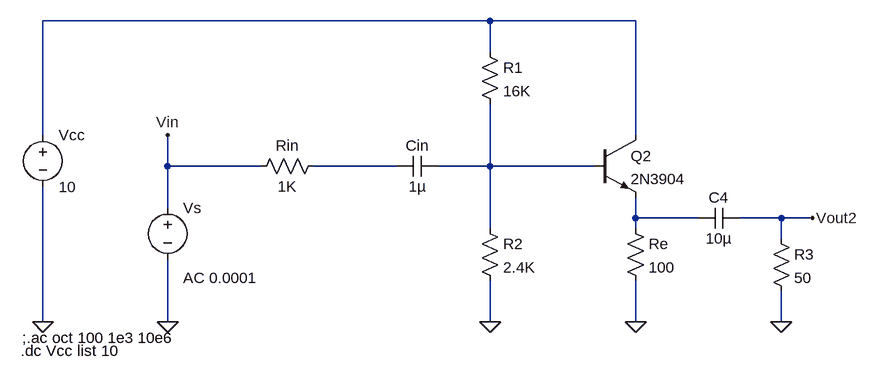
[diagram p0: schematic transistor_common_collector.asc]
transistor_common_collector.asc, the LTspice schematic file:
Version 4
SHEET 1 1368 680
WIRE 240 32 -448 32
WIRE 464 32 240 32
WIRE 240 80 240 32
WIRE -448 208 -448 32
WIRE 464 208 464 32
WIRE -256 256 -256 208
WIRE -112 256 -256 256
WIRE 96 256 -32 256
WIRE 240 256 240 160
WIRE 240 256 160 256
WIRE 400 256 240 256
WIRE -256 320 -256 256
WIRE 464 336 464 304
WIRE 560 336 464 336
WIRE 688 336 624 336
WIRE 736 336 688 336
WIRE 240 352 240 256
WIRE 464 352 464 336
WIRE 688 368 688 336
WIRE -448 496 -448 288
WIRE -256 496 -256 400
WIRE 240 496 240 432
WIRE 464 496 464 432
WIRE 688 496 688 448
FLAG -256 496 0
FLAG -448 496 0
FLAG -256 208 Vin
FLAG 464 496 0
FLAG 240 496 0
FLAG 736 336 Vout2
FLAG 688 496 0
SYMBOL voltage -448 192 R0
WINDOW 123 0 0 Left 0
WINDOW 39 0 0 Left 0
SYMATTR InstName Vcc
SYMATTR Value 10
SYMBOL voltage -256 304 R0
WINDOW 123 24 124 Left 2
WINDOW 39 0 0 Left 0
SYMATTR Value2 AC 0.0001
SYMATTR InstName Vs
SYMATTR Value ""
SYMBOL res 224 64 R0
SYMATTR InstName R1
SYMATTR Value 16K
SYMBOL res 224 336 R0
SYMATTR InstName R2
SYMATTR Value 2.4K
SYMBOL res 448 336 R0
SYMATTR InstName Re
SYMATTR Value 100
SYMBOL npn 400 208 R0
SYMATTR InstName Q2
SYMATTR Value 2N3904
SYMBOL cap 160 240 R90
WINDOW 0 0 32 VBottom 2
WINDOW 3 32 32 VTop 2
SYMATTR InstName Cin
SYMATTR Value 1µ
SYMBOL res -16 240 R90
WINDOW 0 0 56 VBottom 2
WINDOW 3 32 56 VTop 2
SYMATTR InstName Rin
SYMATTR Value 1K
SYMBOL cap 624 320 R90
WINDOW 0 0 32 VBottom 2
WINDOW 3 32 32 VTop 2
SYMATTR InstName C4
SYMATTR Value 10µ
SYMBOL res 672 352 R0
SYMATTR InstName R3
SYMATTR Value 50
TEXT -480 520 Left 2 !;.ac oct 100 1e3 10e6
TEXT -482 540 Left 2 !.dc Vcc list 10

The netlist it stands for:
* transistor_common_collector.asc
Vcc N001 0 10
Vs Vin 0 AC 0.0001
R1 N001 N003 16K
R2 N003 0 2.4K
Re N004 0 100
Q2 N001 N003 N004 0 2N3904
Cin N003 N002 1µ
Rin N002 Vin 1K
C4 Vout2 N004 10µ
R3 Vout2 0 50
.model NPN NPN
.model PNP PNP
.lib standard.bjt
;.ac oct 100 1e3 10e6
.dc Vcc list 10
.backanno
.end